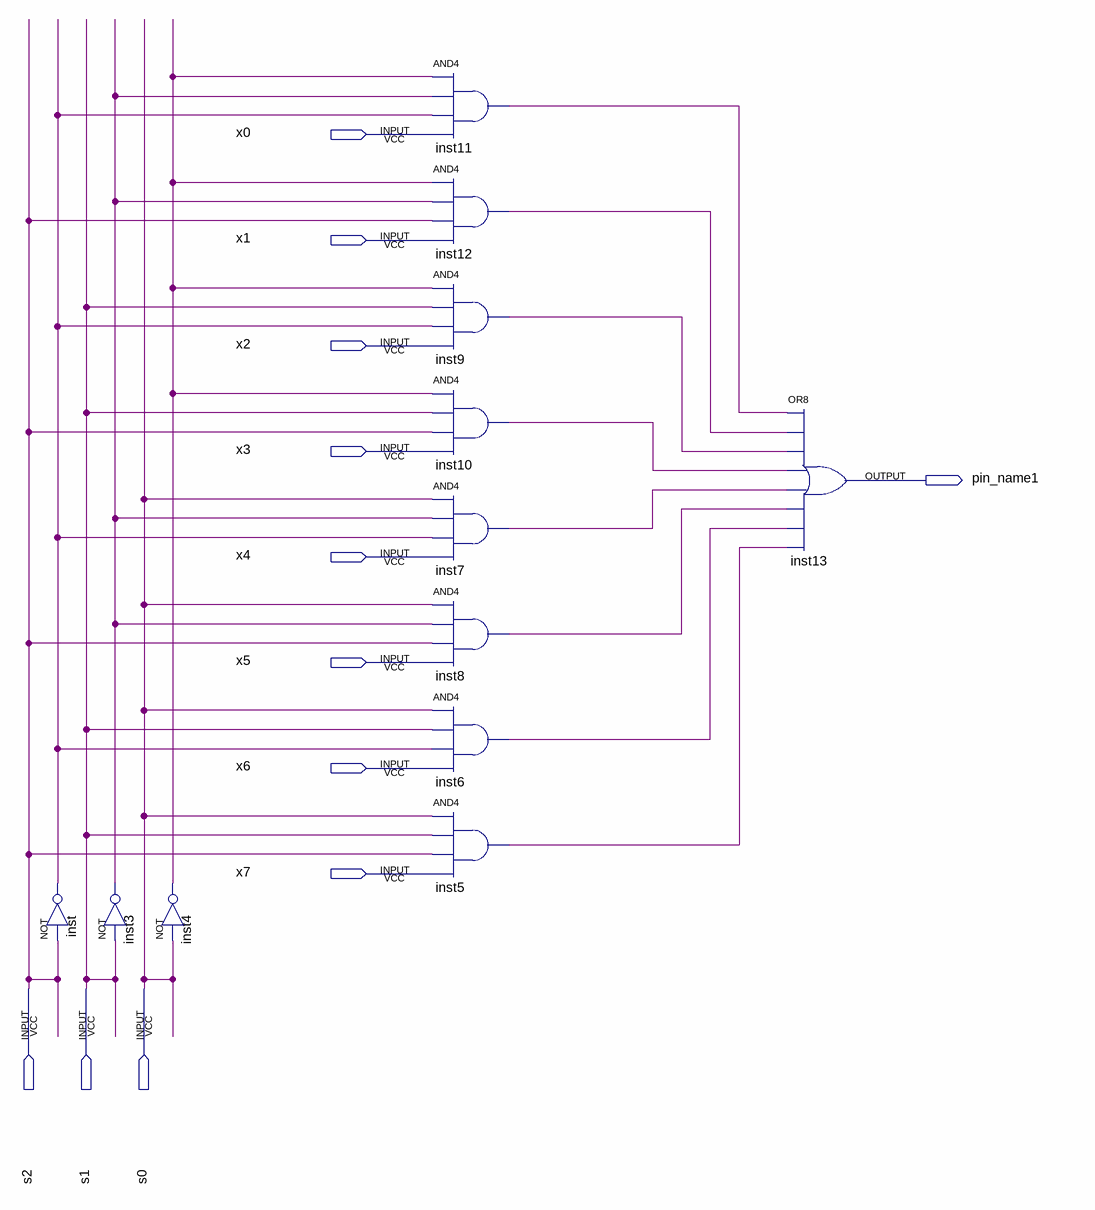
[diagram p0: schematic sheet]
// Quartus schematic balandin_vladislav_3.bdf as structural Verilog: 12 symbols, 12 pins
module balandin_vladislav_3 (
  input  x0,
  input  x1,
  input  x2,
  input  x3,
  input  x4,
  input  x5,
  input  x6,
  input  x7,
  input  s2,
  input  s1,
  input  s0,
  output pin_name1
);

  wire inst3_out, inst4_out, inst5_out, inst6_out, inst7_out, inst8_out, inst9_out, inst10_out, inst11_out,
       inst12_out, inst_out;

  not inst (inst_out, s2);
  not inst3 (inst3_out, s1);
  not inst4 (inst4_out, s0);
  and inst11 (inst11_out, inst4_out, inst3_out, inst_out, x0);
  and inst12 (inst12_out, inst4_out, inst3_out, s2, x1);
  and inst9 (inst9_out, inst4_out, s1, inst_out, x2);
  and inst10 (inst10_out, inst4_out, s1, s2, x3);
  and inst7 (inst7_out, s0, inst3_out, inst_out, x4);
  and inst8 (inst8_out, s0, inst3_out, s2, x5);
  and inst6 (inst6_out, s0, s1, inst_out, x6);
  and inst5 (inst5_out, s0, s1, s2, x7);
  or inst13 (pin_name1, inst11_out, inst12_out, inst9_out, inst10_out, inst7_out, inst8_out, inst6_out, inst5_out);
endmodule
